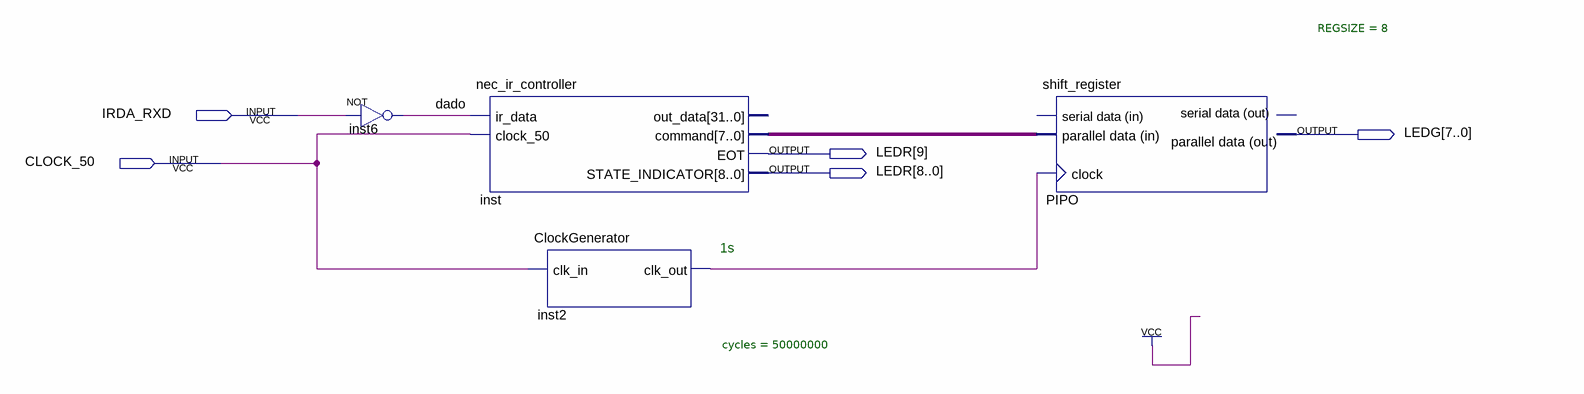
[diagram p0: schematic sheet]
// Quartus schematic nec_ir_controller_test.bdf as structural Verilog: 4 symbols, 5 pins
module nec_ir_controller_test (
  input  IRDA_RXD,
  input  CLOCK_50,
  output [7:0] LEDG,
  output [9:0] LEDR
);

  wire dado, inst2_clk_out;
  wire [7:0] inst_command;

  not inst6 (dado, IRDA_RXD);
  nec_ir_controller inst (
    .ir_data(dado), .clock_50(CLOCK_50), .command(inst_command), .EOT(LEDR[9]), .STATE_INDICATOR(LEDR[8:0]));  // open: out_data
  ClockGenerator #(.cycles(50000000)) inst2 (.clk_in(CLOCK_50), .clk_out(inst2_clk_out));
  shift_register #(.REGSIZE(8)) PIPO (
    .p_data_in(inst_command), .clk(inst2_clk_out), .p_data_out(LEDG));  // open: s_data_in, s_data_out

  // Notes on the sheet:
  //   1s
endmodule
